# Altium schematic sheet Connecters.SchDoc
size A3; SheetNumber: 7; SheetTotal: 7
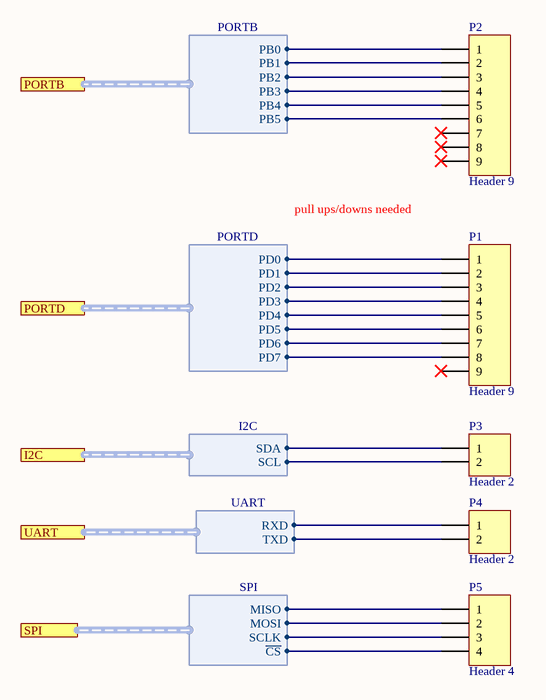
[diagram p0: Connecters.SchDoc]

## Parts
P1  Header 9  [HDR1X9]
P2  Header 9  [HDR1X9]
P3  Header 2  [HDR1X2]
P4  Header 2  [HDR1X2]
P5  Header 4  [HDR1X4]

## Ports
I2C (harness I2C), PORTB (harness PORTB), PORTD (harness PORTD), SPI (harness SPI), UART (harness UART)

## Harnesses
PORTB: PB0, PB1, PB2, PB3, PB4, PB5
PORTD: PD0, PD1, PD2, PD3, PD4, PD5, PD6, PD7
I2C: SDA, SCL
UART: RXD, TXD
SPI: MISO, MOSI, SCLK, ~{CS}

## Nets
NetP1_1: P1.1 ; port PORTD.PD0
NetP1_2: P1.2 ; port PORTD.PD1
NetP1_3: P1.3 ; port PORTD.PD2
NetP1_4: P1.4 ; port PORTD.PD3
NetP1_5: P1.5 ; port PORTD.PD4
NetP1_6: P1.6 ; port PORTD.PD5
NetP1_7: P1.7 ; port PORTD.PD6
NetP1_8: P1.8 ; port PORTD.PD7
NetP2_1: P2.1 ; port PORTB.PB0
NetP2_2: P2.2 ; port PORTB.PB1
NetP2_3: P2.3 ; port PORTB.PB2
NetP2_4: P2.4 ; port PORTB.PB3
NetP2_5: P2.5 ; port PORTB.PB4
NetP2_6: P2.6 ; port PORTB.PB5
NetP3_1: P3.1 ; port I2C.SDA
NetP3_2: P3.2 ; port I2C.SCL
NetP4_1: P4.1 ; port UART.RXD
NetP4_2: P4.2 ; port UART.TXD
NetP5_1: P5.1 ; port SPI.MISO
NetP5_2: P5.2 ; port SPI.MOSI
NetP5_3: P5.3 ; port SPI.SCLK
NetP5_4: P5.4 ; port SPI.~{CS}

Not connected (* = marked no-connect by the designer): P1 9*; P2 7* 8* 9*

## Notes on the sheet
- pull ups/downs needed

## Library data of the parts
P1 P2 = Header 9: Header, 9-Pin; LatestRevisionDate: 17-Jul-2002; LatestRevisionNote: Re-released for DXP Platform.; Publisher: Altium Limited
P3 P4 = Header 2: Header, 2-Pin; LatestRevisionDate: 17-Jul-2002; LatestRevisionNote: Re-released for DXP Platform.; Publisher: Altium Limited
P5 = Header 4: Header, 4-Pin; LatestRevisionDate: 17-Jul-2002; LatestRevisionNote: Re-released for DXP Platform.; Publisher: Altium Limited